# Altium schematic sheet CON_USBA_RA_UPRIGHT.SchDoc: USBA RA Upright Connector
size A4; Organization: Altium Limited.; DocumentNumber: 54; SheetNumber: 55; SheetTotal: 78
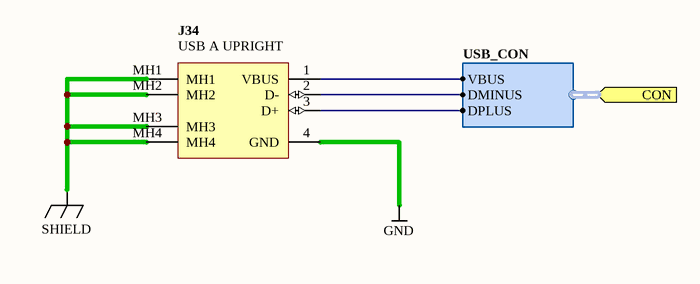
[diagram p0: CON_USBA_RA_UPRIGHT.SchDoc]

## Parts
J34  USB A UPRIGHT  [482040001]

## Ports
CON (harness USB_CON)

## Harnesses
USB_CON: VBUS, DMINUS, DPLUS

## Nets
GND: J34.4(GND)
SHIELD: J34.MH1 J34.MH2 J34.MH3 J34.MH4
NetJ34_1: J34.1(VBUS) ; port CON.VBUS
NetJ34_2: J34.2(D-) ; port CON.DMINUS
NetJ34_3: J34.3(D+) ; port CON.DPLUS

## Notes on the sheet
- Sheet Title
- Project Title
- Size:
- Date:
- A4
- Assy:
- Time:
- Revision:
- Sheet
- of
- File:

## Library data of the parts
J34 = D-300-0127: CONNECTOR USB RT ANG RECEPT TYPE A; Connector type: Header; Max Current: mA; Mounting Technology: Through-Hole; Status: Production; Category: Connector; Pin Count: 4